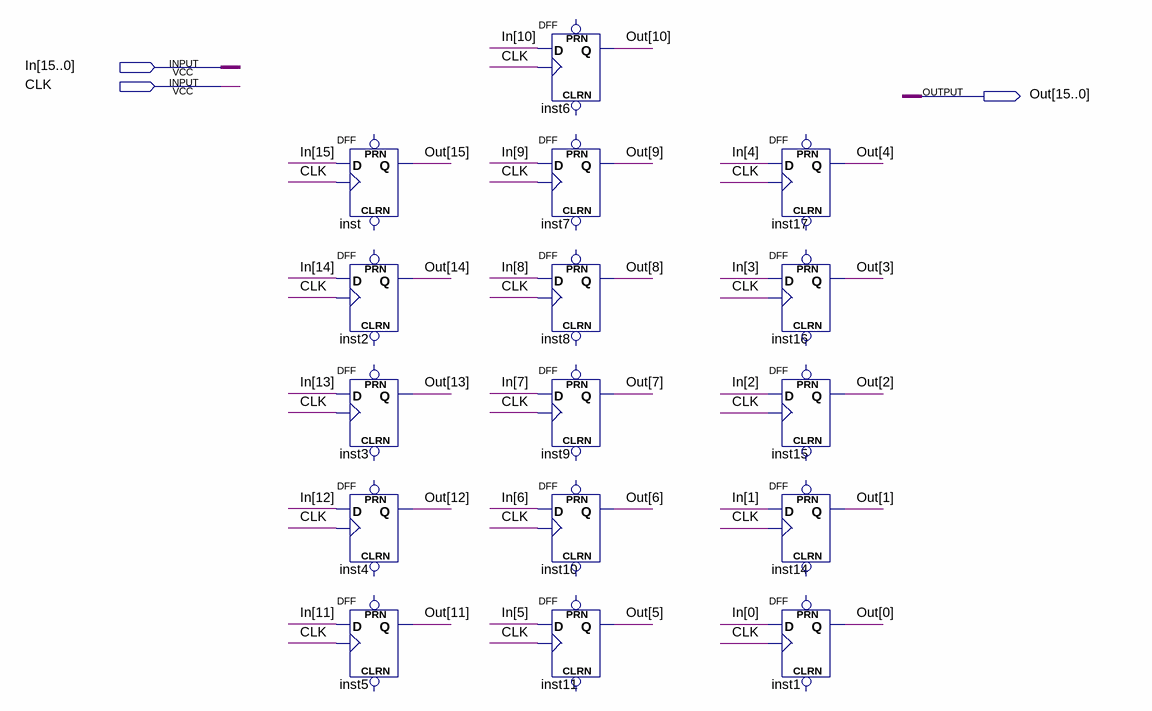
[diagram p0: schematic sheet]
// Quartus schematic PC_Register.bdf as structural Verilog: 16 symbols, 3 pins
module PC_Register (
  input  [15:0] In,
  input  CLK,
  output [15:0] Out
);

  DFF inst (.CLK(CLK), .D(In[15]), .Q(Out[15]));  // open: CLRN, PRN
  DFF inst2 (.CLK(CLK), .D(In[14]), .Q(Out[14]));  // open: CLRN, PRN
  DFF inst3 (.CLK(CLK), .D(In[13]), .Q(Out[13]));  // open: CLRN, PRN
  DFF inst4 (.CLK(CLK), .D(In[12]), .Q(Out[12]));  // open: CLRN, PRN
  DFF inst5 (.CLK(CLK), .D(In[11]), .Q(Out[11]));  // open: CLRN, PRN
  DFF inst6 (.CLK(CLK), .D(In[10]), .Q(Out[10]));  // open: CLRN, PRN
  DFF inst7 (.CLK(CLK), .D(In[9]), .Q(Out[9]));  // open: CLRN, PRN
  DFF inst8 (.CLK(CLK), .D(In[8]), .Q(Out[8]));  // open: CLRN, PRN
  DFF inst9 (.CLK(CLK), .D(In[7]), .Q(Out[7]));  // open: CLRN, PRN
  DFF inst10 (.CLK(CLK), .D(In[6]), .Q(Out[6]));  // open: CLRN, PRN
  DFF inst11 (.CLK(CLK), .D(In[5]), .Q(Out[5]));  // open: CLRN, PRN
  DFF inst17 (.CLK(CLK), .D(In[4]), .Q(Out[4]));  // open: CLRN, PRN
  DFF inst16 (.CLK(CLK), .D(In[3]), .Q(Out[3]));  // open: CLRN, PRN
  DFF inst15 (.CLK(CLK), .D(In[2]), .Q(Out[2]));  // open: CLRN, PRN
  DFF inst14 (.CLK(CLK), .D(In[1]), .Q(Out[1]));  // open: CLRN, PRN
  DFF inst1 (.CLK(CLK), .D(In[0]), .Q(Out[0]));  // open: CLRN, PRN
endmodule
